# EAGLE design RQ2_analog (EAGLE 7.7.0)
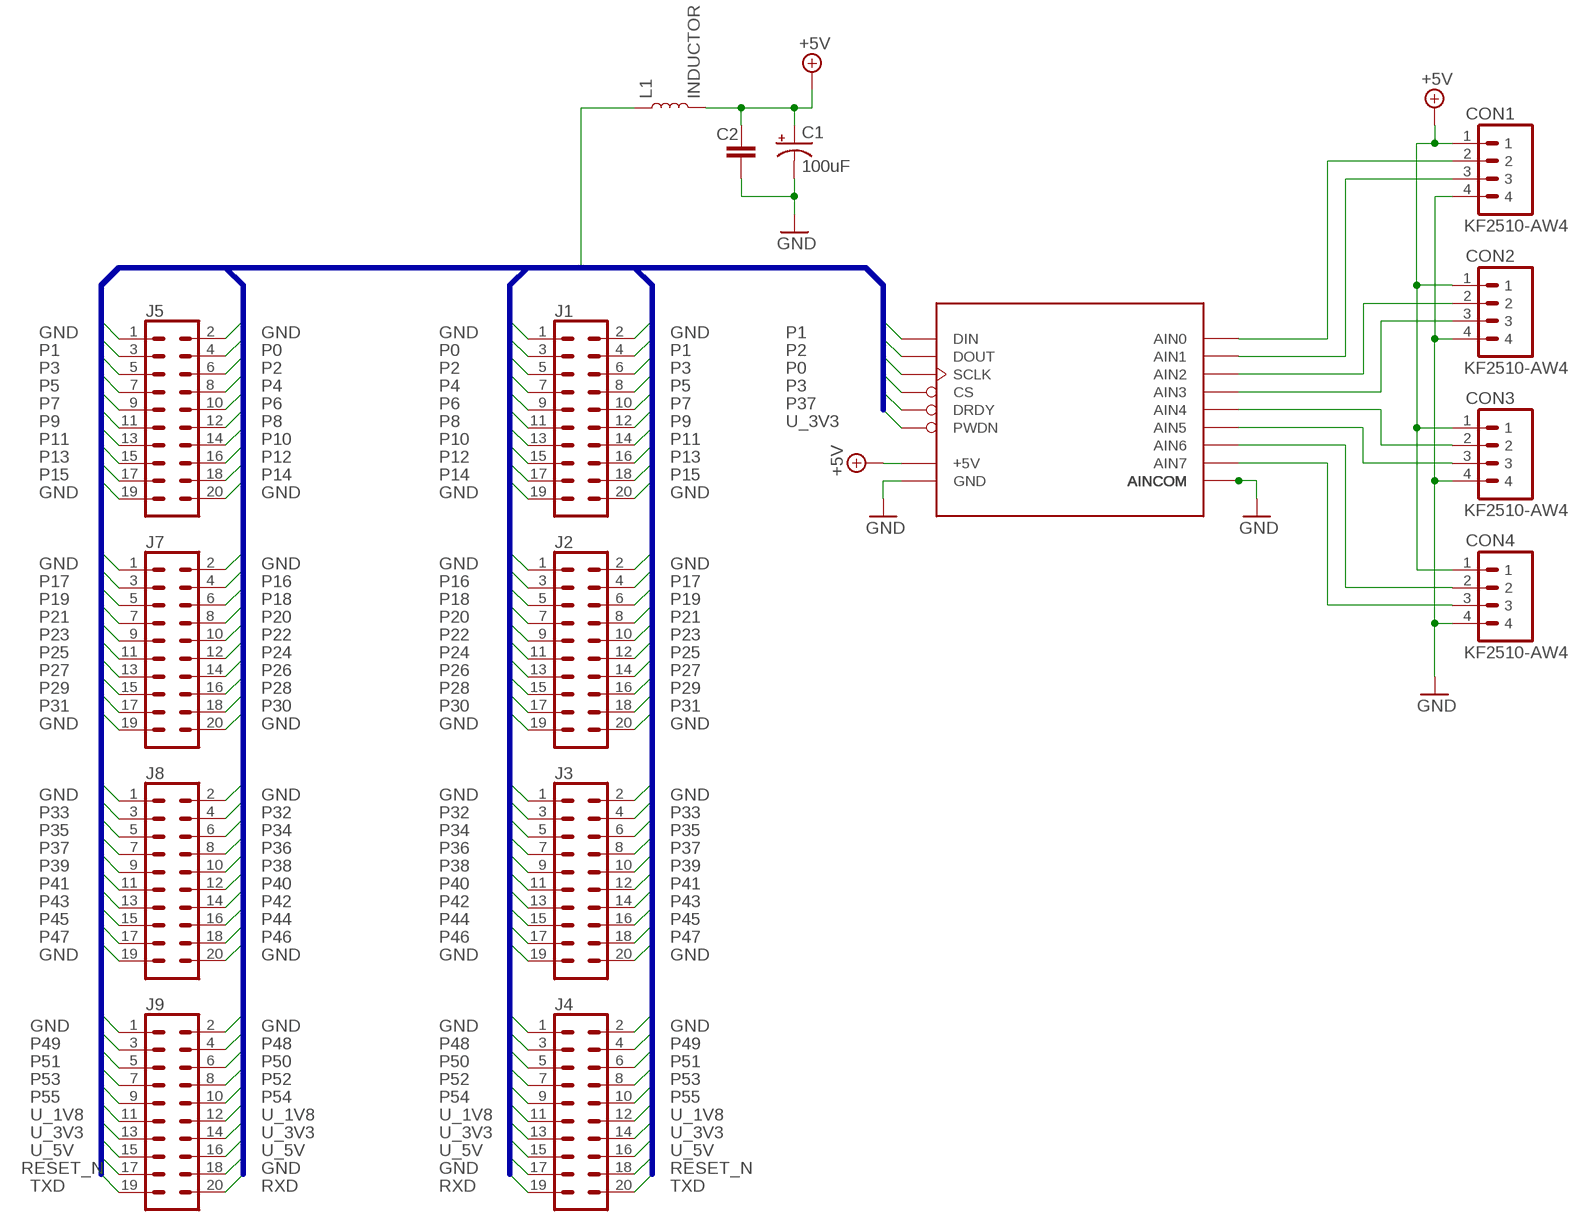
[diagram p0: schematic, sheet 1]

## Parts
C1  100uF  100UF-POLAR-10X10.5-63V-20%  [NIC_10X10.5_CAP]
C2  22uF  22UF-1210-16V-20%  [1210]
CON1  KF2510-AW4  [KF2510-AW4]
CON2  KF2510-AW4  [KF2510-AW4]
CON3  KF2510-AW4  [KF2510-AW4]
CON4  KF2510-AW4  [KF2510-AW4]
J1  CONN_10X2SMT  [2X10_SMT]
J2  CONN_10X2SMT  [2X10_SMT]
J3  CONN_10X2SMT  [2X10_SMT]
J4  CONN_10X2SMT  [2X10_SMT]
J5  CONN_10X2SMT  [2X10_SMT]
J7  CONN_10X2SMT  [2X10_SMT]
J8  CONN_10X2SMT  [2X10_SMT]
J9  CONN_10X2SMT  [2X10_SMT]
L1  INDUCTOR  [1040]
U$1  ADS1256_MODULE  [ADS1256_MODULE]

## Nets
+5V: C1.+ C2.1 CON1.1 CON2.1 CON3.1 CON4.1 L1.2 U$1.+5V
GND: C1.- C2.2 CON1.4 CON2.4 CON3.4 CON4.4 J1.1 J1.2 J1.19 J1.20 J2.1 J2.2 J2.19 J2.20 J3.1 J3.2 J3.19 J3.20 J4.1 J4.2 J4.17 J5.1 J5.2 J5.19 J5.20 J7.1 J7.2 J7.19 J7.20 J8.1 J8.2 J8.19 J8.20 J9.1 J9.2 J9.18 U$1.AINCOM0(AINCOM) U$1.AINCOM1(AINCOM) U$1.AINCOM2(AINCOM) U$1.AINCOM3(AINCOM) U$1.AINCOM4(AINCOM) U$1.AINCOM5(AINCOM) U$1.AINCOM6(AINCOM) U$1.AINCOM7(AINCOM) U$1.GND
N$1: CON1.2 U$1.AIN0
N$2: CON1.3 U$1.AIN1
N$3: CON2.2 U$1.AIN2
N$4: CON2.3 U$1.AIN3
N$5: CON3.2 U$1.AIN4
N$6: CON3.3 U$1.AIN5
N$7: CON4.2 U$1.AIN6
N$8: CON4.3 U$1.AIN7
P0: J1.3 J5.4 U$1.SCLK
P1: J1.4 J5.3 U$1.DIN
P2: J1.5 J5.6 U$1.DOUT
P3: J1.6 J5.5 U$1.CS
P4: J1.7 J5.8
P5: J1.8 J5.7
P6: J1.9 J5.10
P7: J1.10 J5.9
P8: J1.11 J5.12
P9: J1.12 J5.11
P10: J1.13 J5.14
P11: J1.14 J5.13
P12: J1.15 J5.16
P13: J1.16 J5.15
P14: J1.17 J5.18
P15: J1.18 J5.17
P16: J2.3 J7.4
P17: J2.4 J7.3
P18: J2.5 J7.6
P19: J2.6 J7.5
P20: J2.7 J7.8
P21: J2.8 J7.7
P22: J2.9 J7.10
P23: J2.10 J7.9
P24: J2.11 J7.12
P25: J2.12 J7.11
P26: J2.13 J7.14
P27: J2.14 J7.13
P28: J2.15 J7.16
P29: J2.16 J7.15
P30: J2.17 J7.18
P31: J2.18 J7.17
P32: J3.3 J8.4
P33: J3.4 J8.3
P34: J3.5 J8.6
P35: J3.6 J8.5
P36: J3.7 J8.8
P37: J3.8 J8.7 U$1.DRDY
P38: J3.9 J8.10
P39: J3.10 J8.9
P40: J3.11 J8.12
P41: J3.12 J8.11
P42: J3.13 J8.14
P43: J3.14 J8.13
P44: J3.15 J8.16
P45: J3.16 J8.15
P46: J3.17 J8.18
P47: J3.18 J8.17
P48: J4.3 J9.4
P49: J4.4 J9.3
P50: J4.5 J9.6
P51: J4.6 J9.5
P52: J4.7 J9.8
P53: J4.8 J9.7
P54: J4.9 J9.10
P55: J4.10 J9.9
RESET_N: J4.18 J9.17
RXD: J4.19 J9.20
TXD: J4.20 J9.19
U_1V8: J4.11 J4.12 J9.11 J9.12
U_3V3: J4.13 J4.14 J9.13 J9.14 U$1.PWDN
U_5V: J4.15 J4.16 J9.15 J9.16 L1.1

## Buses
P[0..55],RXD,TXD,BOOT_SCLK,BOOT_MISO,BOOT_MOSI,RESET_N,XIN,XOUT,U_1V8,U_3V3,U_5V,U_IN,GND

## Library data of the parts
C1 = SparkFun-Capacitors:100UF-POLAR: 100µF polarized capacitors A capacitor is a passive two-terminal electrical component used to store electrical energy temporarily in an electric field.; PROD_ID: CAP-08362
C2 = SparkFun-Capacitors:22UF: 22µF ceramic capacitors A capacitor is a passive two-terminal electrical component used to store electrical energy temporarily in an electric field.
CON1-CON4 = connector:KF2510-AW4
J1-J5 J7-J9 = SparkFun-Connectors:CONN_10X2: Multi connection point. Often used as Generic Header-pin footprint for 0.1 inch spaced/style header connections On any of the 0.1 inch spaced packages, you can populate with these: Break Away Headers - Straight <https://www.sparkfun.com/products/116> (PRT-00116) Break Away Male Headers - Right Angle <https://www.sparkfun.com/products/553> (PRT-00553) Female Headers <https://www.sparkfun.com/products/115> (PRT-00115) Break Away Headers - Machine Pin <https://www.sparkfun.com/products/117> (PRT-00117) Break Away Female Headers - Swiss Machine Pin <https://www.sparkfun.com/products/743> (PRT-00743) Special note about the "SPECIAL" package: This was SPECIALLY designed to be used with our Graphic LCD Backpack. Be sure you want to use this! It is not only staggered on each line of header holes, but IT IS ALSO offset of the center point of the top and bottom lines by 5 mil. This causes the headers to lock into place on the "standard" footprint on the LCD screen. The extra squares on the tdocu layer are there simply to reference other pins (if you were to actually populate a longer header than ten long - this is what we do with the backpacks).
L1 = SparkFun-Coils:INDUCTOR: Inductors Resist changes in electrical current. Basically a coil of wire. SparkFun Products: SparkFun Load Cell Amplifier - HX711 <https://www.sparkfun.com/products/13879> IOIO-OTG - V2.2 <https://www.sparkfun.com/products/13613>
U$1 = arduino_modules:ADS1256_MODULE

## Board
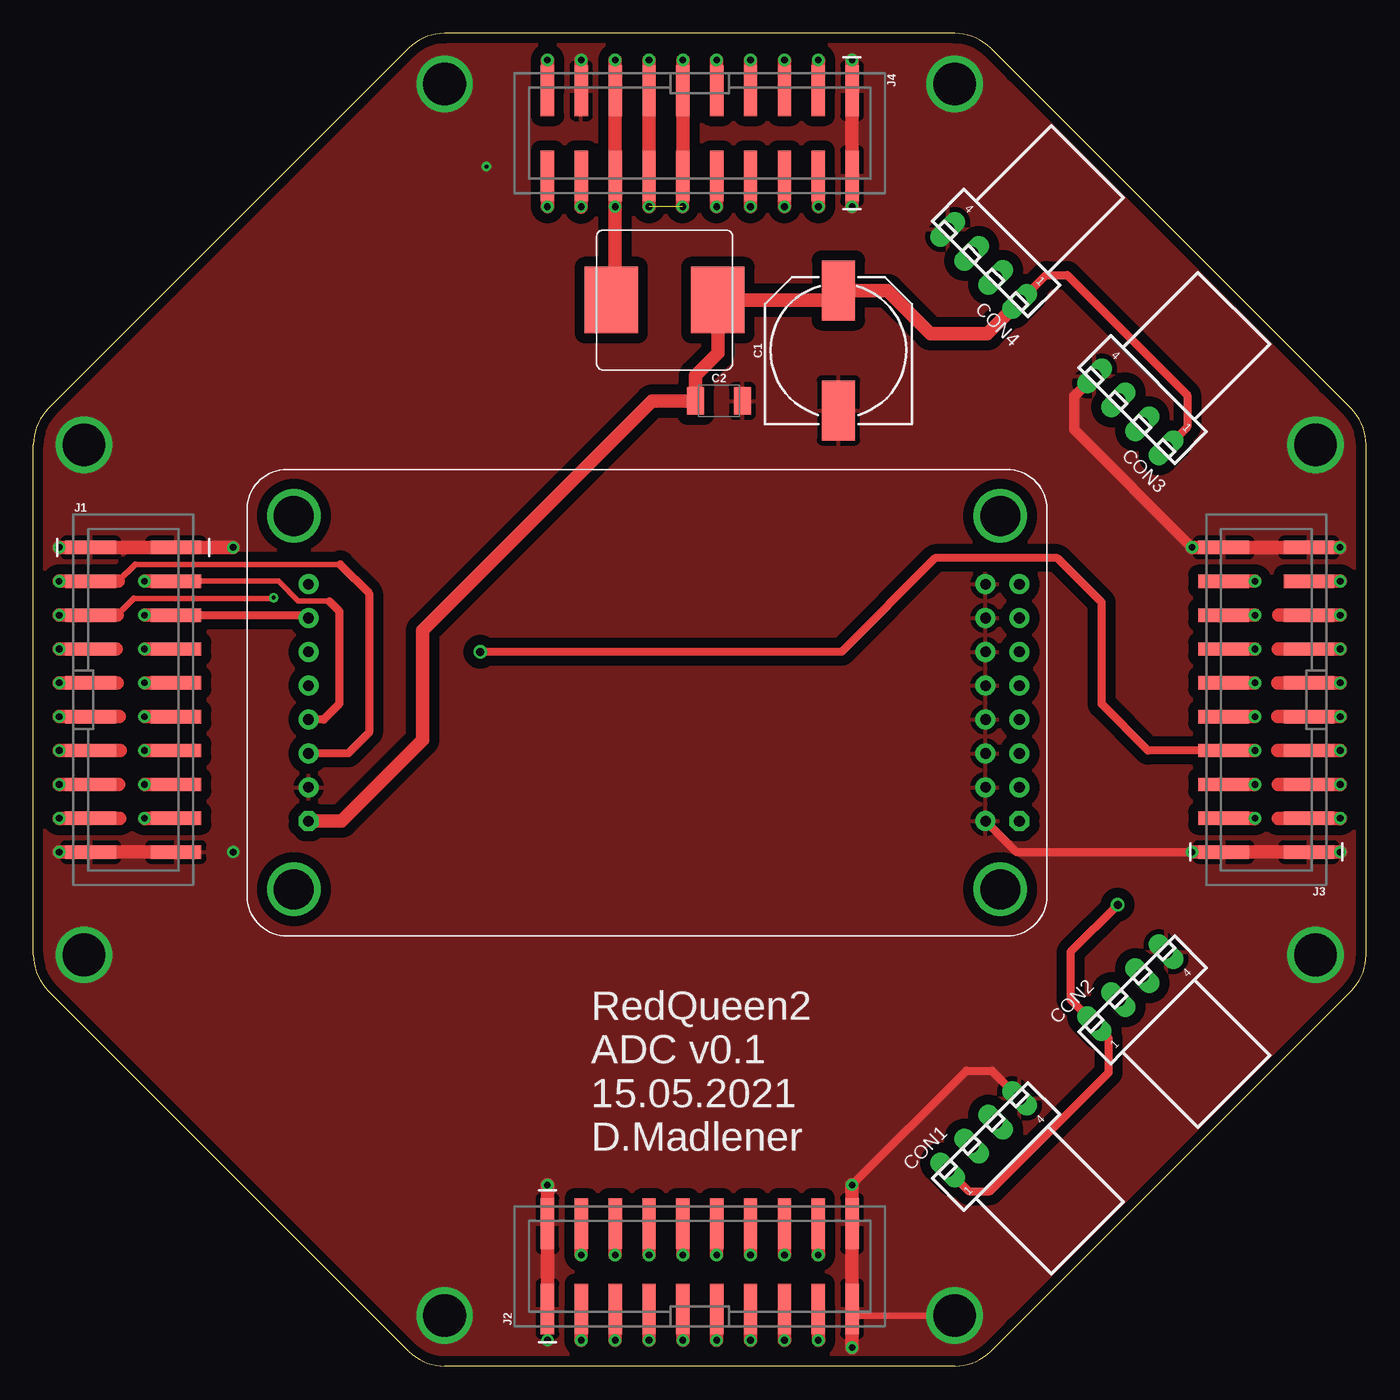
[diagram p1: board, top side]
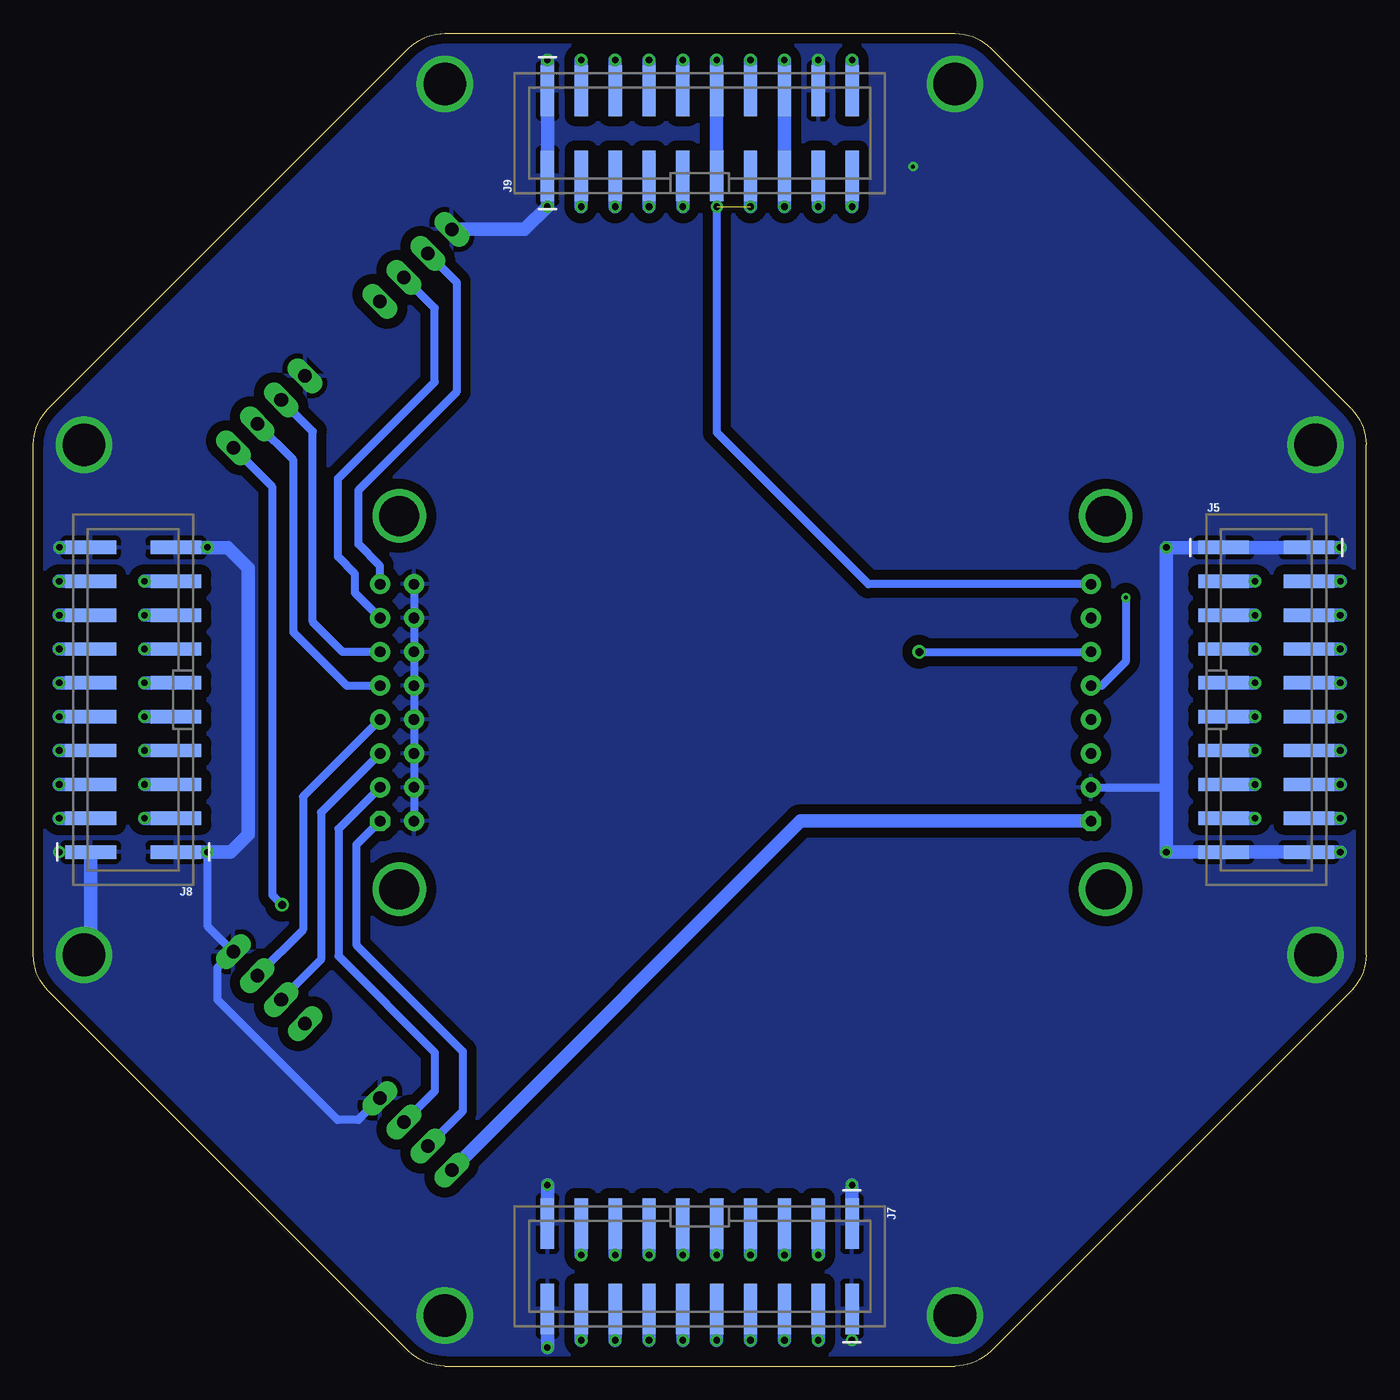
[diagram p2: board, bottom side, seen from below]

Size 100 x 100 mm. Coordinates in mm from the lower left corner, seen from the top.
Outline: 73.64,2.93 73.64,2.93
Outline: 97.07,73.64 97.07,73.64
Outline: 73.64,97.07 73.64,97.07
Outline: 98.89,28.17 arc45 100,30.86 100,69.14 arc45 98.89,71.83 71.83,98.89 arc45 69.13,100 30.86,100 arc45 28.17,98.89 1.11,71.83 arc45 0,69.14 0,30.87 arc45 1.11,28.18 28.18,1.11 arc45 30.87,0 69.13,0 arc45 71.83,1.11 98.89,28.17
Copper layers (1*16): Top 0.035mm / dielectric 1.5mm / Bottom 0.035mm
Design rules "default *": minimum track width 0.2mm, minimum drill 0.3mm, track to track 6mil, track to pad 6mil, pad to pad 6mil, via to via 6mil, smd to smd 6mil, copper to edge 6mil, drill to drill 6mil, minimum pad ring 10mil, minimum via ring 8mil, stop-mask expansion 4mil, vias tented up to drill 0mil, thermal gap 15mil

### Footprints (pad centres in the part's own frame; a part is rotated, then mirrored left to right if it is on the bottom)
NIC_10X10.5_CAP = smd 4.5 x 2.5: + 4.5,0; - -4.5,0
1210 = smd 1.27 x 2.06: 1 -1.755,0; 2 1.755,0
KF2510-AW4 = drill 1.016 long: 1 0,0; 2 2.54,0; 3 5.08,0; 4 7.62,0
2X10_SMT = smd 3.8 x 1: 1 -3.2,11.43; 2 3.2,11.43; 3 -3.2,8.89; 4 3.2,8.89; 5 -3.2,6.35; 6 3.2,6.35; 7 -3.2,3.81; 8 3.2,3.81; 9 -3.2,1.27; 10 3.2,1.27; 11 -3.2,-1.27; 12 3.2,-1.27; 13 -3.2,-3.81; 14 3.2,-3.81; 15 -3.2,-6.35; 16 3.2,-6.35; 17 -3.2,-8.89; 18 3.2,-8.89; 19 -3.2,-11.43; 20 3.2,-11.43
1040 = smd 4 x 5: 1 -4,0; 2 4,0
ADS1256_MODULE = drill 0.8 pad 1.5 octagon: +5V 53.34,0; AIN0 0,0 | drill 0.8 pad 1.5: AIN1 0,-2.54; AIN2 0,-5.08; AIN3 0,-7.62; AIN4 0,-10.16; AIN5 0,-12.7; AIN6 0,-15.24; AIN7 0,-17.78; AINCOM0 2.54,0; AINCOM1 2.54,-2.54; AINCOM2 2.54,-5.08; AINCOM3 2.54,-7.62; AINCOM4 2.54,-10.16; AINCOM5 2.54,-12.7; AINCOM6 2.54,-15.24; AINCOM7 2.54,-17.78; CS 53.34,-15.24; DIN 53.34,-7.62; DOUT 53.34,-10.16; DRDY 53.34,-12.7; GND 53.34,-2.54; PWDN 53.34,-17.78; SCLK 53.34,-5.08 | drill 3: P$1 1.44,-22.89; P$2 1.44,5.11; P$3 54.44,5.11; P$4 54.44,-22.89

### Placement (x,y rotation side)
C1  60.4,76.2 90 top
C2  51.44,72.42 0 top
CON1  68.61,14.71 45 top
CON2  79.61,25.71 45 top
CON3  85,68.9 135 top
CON4  74,79.9 135 top
J1  7.5,50 0 top
J2  50,7.5 90 top
J3  92.5,50 180 top
J4  50,92.5 270 top
J5  7.5,50 0 bottom
J7  50,7.5 270 bottom
J8  92.5,50 180 bottom
J9  50,92.5 90 bottom
L1  47.36,79.99 0 top
U$1  73.98,40.89 180 top

### Tracks (layer width: path | path; a pad name or v marks a point on that pad's centre or on a via)
+5V  (via drill 0.6)
  Top 0.6: CON4.1 75.97,81.87 77.57,81.87 86.57,72.87 86.57,70.47 CON3.1 | v81.35,34.62 77.81,31.08 77.81,27.51 CON2.1 80.69,24.63 80.69,22.04 71.78,13.13 70.19,13.13 CON1.1
  Top 1: CON4.1 71.57,77.47 67.31,77.47 64.08,80.7 C1.+ 59.69,79.99 L1.2 51.36,76.01 49.69,74.33 C2.1 46.42,72.42 29.21,55.21 29.21,46.99 23.12,40.9 U$1.+5V
  Bottom 0.6: v81.35,34.62 82.05,35.32 82.05,65.95 CON3.1
  Bottom 1: U$1.+5V 42.43,40.89 CON1.1
GND  (via drill 0.3, 0.5, 3.2)
  Top 0.3: 92.94,61.45 92.95,61.43
  Top 0.5: 61.43,88.94 61.4,88.91 | J7.20 61.93,3.8 v69.12,3.8
  Top 0.6: U$1.AINCOM0 73.77,38.57 v86.94,38.57 | v61.43,13.6 69.99,22.16 71.94,22.16 CON1.4
  Top 0.8: v86.94,61.44 78.1,70.27 78.1,72.78 CON3.4
  Top 1: J7.2 J7.1 v38.57,13.6 | J5.19 J5.20 v1.94,38.57 | v61.43,13.6 J7.19 J7.20 v61.43,1.4 | v98.06,38.57 J8.2 J8.1 v86.94,38.57 | v98.03,61.43 J8.20 92.95,61.43 J8.19 | v61.43,98 J9.2 61.43,88.94 | J9.1 v61.43,87 | 88.93,61.44 v86.94,61.44 | v1.94,61.43 J5.2 J5.1 v14.99,61.43 | J4.17 v41.11,98
  Bottom 0.406: 14.99,43.43 14.99,43.6
  Bottom 0.6: U$1.GND 14.99,43.43 | U$1.AINCOM7 U$1.AINCOM6 U$1.AINCOM5 U$1.AINCOM4 U$1.AINCOM3 U$1.AINCOM2 U$1.AINCOM1 U$1.AINCOM0 | CON1.4 75.62,18.48 77.17,18.48 86.18,27.49 86.18,29.92 CON2.4 86.94,33.04 v86.94,38.57
  Bottom 0.8: v14.99,38.57 v14.99,38.58
  Bottom 1: J7.20 v61.43,1.4 | J7.1 v38.57,13.6 | J7.19 v61.43,13.6 | v1.94,38.57 J5.20 J5.19 v14.99,38.57 | v1.94,61.43 J5.2 J5.1 v14.99,61.43 14.99,43.6 v14.99,38.58 | v61.43,98 J9.2 J9.1 v61.43,87 63.14,85.29 CON4.4 | J8.19 v86.94,61.44 85.44,61.44 83.89,59.89 83.89,39.89 85.21,38.57 v86.94,38.57 J8.1 | J8.20 v98.03,61.43 | J8.2 95.7,31.36 v96.2,30.86 | v41.11,98 J4.17
  other vias: 30.86,3.8 3.8,30.86 3.8,69.12 69.12,96.2 96.2,69.12 30.86,96.2 38.58,1.94 34,90
  pour Top (isolate 0.75): 100,29.32 70.7,0 29.3,0 0,29.3 0,70.7 29.3,100 70.7,100 100,70.7
  pour Bottom (isolate 0.75): 0.01,29.34 29.31,0.03 70.71,0.03 100.01,29.33 100.01,70.73 70.71,100.03 29.31,100.03 0.01,70.73
N$1
  Bottom 0.6: U$1.AIN0 75.77,39.11 75.77,31.61 67.79,23.63 67.79,19.12 CON1.2
N$2
  Bottom 0.6: U$1.AIN1 77.11,40.31 77.11,30.77 69.88,23.54 69.88,20.62 CON1.3
N$3
  Bottom 0.6: U$1.AIN2 78.41,41.55 78.41,30.5 CON2.2
N$4
  Bottom 0.6: U$1.AIN3 79.76,42.74 79.76,32.74 CON2.3
N$5
  Bottom 0.6: U$1.AIN4 76.48,51.05 80.48,55.05 80.48,67.97 CON3.2
N$6
  Bottom 0.6: U$1.AIN5 76.79,53.59 79.04,55.84 79.04,70.12 CON3.3
N$7
  Bottom 0.6: U$1.AIN6 75.86,58.01 75.86,59.45 77.14,60.73 77.14,66.6 69.89,73.85 69.89,79.38 CON4.2
N$8
  Bottom 0.6: U$1.AIN7 73.98,60.04 75.61,61.67 75.61,65.72 68.21,73.12 68.21,81.29 CON4.3
P0  (via drill 0.5)
  Top 0.406: 7.65,60.16 23.03,60.16
  Top 0.5: 7.65,60.16 6.38,58.89
  Top 0.6: 23.03,60.16 25.19,58 25.19,47.53 23.63,45.97 U$1.SCLK
  Top 1: 6.38,58.89 J5.4 v1.94,58.89
  Bottom 1: v1.94,58.89 J5.4
P1  (via drill 0.5)
  Top 0.406: 22.2,57.4 19.89,57.4 18.4,58.89 J5.3
  Top 0.6: 22.2,57.4 22.96,56.64 22.96,49.69 21.78,48.51 U$1.DIN
  Top 1: J5.3 v8.34,58.89
  Bottom 1: v8.34,58.89 J5.3
P2  (via drill 0.3, 0.5)
  Top 0.406: 7.54,57.6 17.98,57.6 v18.03,57.66
  Top 0.5: 7.54,57.6 6.29,56.35
  Top 1: 6.29,56.35 J5.6 v1.94,56.35
  Bottom 0.6: v18.03,57.66 18.03,52.87 19.85,51.05 U$1.DOUT
  Bottom 1: v1.94,56.35 J5.6
P3  (via drill 0.5)
  Top 0.6: J5.5 20.43,56.35 U$1.CS
  Top 1: J5.5 v8.34,56.35
  Bottom 1: J5.5 v8.34,56.35
P4  (via drill 0.5)
  Top 1: 6.23,53.81 J5.8 v1.94,53.81
  Bottom 1: J5.8 v1.94,53.81
P5  (via drill 0.5)
  Top 1: J5.7 v8.34,53.81
  Bottom 1: v8.34,53.81 J5.7
P6  (via drill 0.5)
  Top 1: 6.29,51.27 J5.10 v1.94,51.27
  Bottom 1: v1.94,51.27 J5.10
P7  (via drill 0.5)
  Top 1: J5.9 v8.34,51.27
  Bottom 1: J5.9 v8.34,51.27
P8  (via drill 0.5)
  Top 1: 6.45,48.73 J5.12 v1.94,48.73
  Bottom 1: J5.12 v1.94,48.73
P9  (via drill 0.5)
  Top 1: J5.11 v8.34,48.73
  Bottom 1: v8.34,48.73 J5.11
P10  (via drill 0.5)
  Top 1: 6.5,46.19 J5.14 v1.94,46.19
  Bottom 1: v1.94,46.19 J5.14
P11  (via drill 0.5)
  Top 1: J5.13 v8.34,46.19
  Bottom 1: J5.13 v8.34,46.19
P12  (via drill 0.5)
  Top 1: 6.39,43.65 J5.16 v1.94,43.65
  Bottom 1: v1.94,43.65 J5.16
P13  (via drill 0.5)
  Top 1: J5.15 v8.34,43.65
  Bottom 1: v8.34,43.65 J5.15
P14  (via drill 0.5)
  Top 1: 6.46,41.11 J5.18 v1.94,41.11
  Bottom 1: J5.18 v1.94,41.11
P15  (via drill 0.5)
  Top 1: J5.17 v8.34,41.11
  Bottom 1: J5.17 v8.34,41.11
P16  (via drill 0.5)
  Top 1: J7.4 v41.11,1.94
  Bottom 1: J7.4 v41.11,1.94
P17  (via drill 0.5)
  Top 1: v41.11,8.34 J7.3
  Bottom 1: J7.3 v41.11,8.34
P18  (via drill 0.5)
  Top 1: J7.6 v43.65,1.94
  Bottom 1: J7.6 v43.65,1.94
P19  (via drill 0.5)
  Top 1: v43.65,8.34 J7.5
  Bottom 1: J7.5 v43.65,8.34
P20  (via drill 0.5)
  Top 1: J7.8 v46.19,1.94
  Bottom 1: J7.8 v46.19,1.94
P21  (via drill 0.5)
  Top 1: J7.7 v46.19,8.34
  Bottom 1: J7.7 v46.19,8.34
P22  (via drill 0.5)
  Top 1: J7.10 v48.73,1.94
  Bottom 1: J7.10 v48.73,1.94
P23  (via drill 0.5)
  Top 1: v48.73,8.34 J7.9
  Bottom 1: J7.9 v48.73,8.34
P24  (via drill 0.5)
  Top 1: J7.12 v51.27,1.94
  Bottom 1: J7.12 v51.27,1.94
P25  (via drill 0.5)
  Top 1: J7.11 v51.27,8.34
  Bottom 1: J7.11 v51.27,8.34
P26  (via drill 0.5)
  Top 1: J7.14 v53.81,1.94
  Bottom 1: J7.14 v53.81,1.94
P27  (via drill 0.5)
  Top 1: J7.13 v53.81,8.35 v53.8,8.34
  Bottom 0.5: v53.81,8.35 v53.8,8.34
  Bottom 1: J7.13 v53.81,8.35
P28  (via drill 0.5)
  Top 1: J7.16 v56.35,1.94
  Bottom 1: J7.16 v56.35,1.94
P29  (via drill 0.5)
  Top 1: J7.15 v56.35,8.34
  Bottom 1: J7.15 v56.35,8.34
P30  (via drill 0.5)
  Top 1: J7.18 v58.89,1.94
  Bottom 1: J7.18 v58.89,1.94
P31  (via drill 0.5)
  Top 1: J7.17 v58.89,8.35 v58.88,8.34
  Bottom 0.5: v58.89,8.35 v58.88,8.34
  Bottom 1: J7.17 v58.89,8.35
P32  (via drill 0.5)
  Top 1: v98.06,41.11 J8.4 93.39,41.11
  Bottom 1: v98.06,41.11 J8.4
P33  (via drill 0.5)
  Top 1: v91.66,41.11 J8.3
  Bottom 1: v91.66,41.11 J8.3
P34  (via drill 0.5)
  Top 1: v98.06,43.65 J8.6 93.42,43.65
  Bottom 1: v98.06,43.65 J8.6
P35  (via drill 0.5)
  Top 1: J8.5 v91.66,43.65
  Bottom 1: v91.66,43.65 J8.5
P36  (via drill 0.5)
  Top 1: v98.06,46.19 J8.8 93.38,46.19
  Bottom 1: v98.06,46.19 J8.8
P37  (via drill 0.5, 0.6)
  Top 0.6: J8.7 83.63,46.19 80.15,49.67 80.15,57.3 76.83,60.62 67.66,60.62 60.64,53.6 v33.53,53.6
  Top 1: J8.7 v91.66,46.19
  Bottom 0.406: U$1.DRDY
  Bottom 0.6: v33.53,53.6 U$1.DRDY
  Bottom 1: v91.66,46.19 J8.7
P38  (via drill 0.5)
  Top 1: v98.06,48.73 J8.10 93.39,48.73
  Bottom 1: v98.06,48.73 J8.10
P39  (via drill 0.5)
  Top 1: J8.9 v91.66,48.73
  Bottom 1: v91.66,48.73 J8.9
P40  (via drill 0.5)
  Top 1: 93.38,51.27 J8.12 v98.06,51.27
  Bottom 1: v98.06,51.27 J8.12
P41  (via drill 0.5)
  Top 1: J8.11 v91.66,51.27
  Bottom 1: v91.66,51.27 J8.11
P42  (via drill 0.5)
  Top 1: v98.06,53.8 v98.05,53.81 J8.14 93.4,53.81
  Bottom 1: J8.14 v98.06,53.8
P43  (via drill 0.5)
  Top 1: J8.13 v91.66,53.81
  Bottom 1: v91.66,53.81 J8.13
P44  (via drill 0.5)
  Top 1: 93.44,56.35 J8.16 v98.06,56.35
  Bottom 1: v98.06,56.35 J8.16
P45  (via drill 0.5)
  Top 1: J8.15 v91.66,56.35
  Bottom 1: v91.66,56.35 J8.15
P46  (via drill 0.5)
  Top 1: J8.18 v98.06,58.89
  Bottom 1: v98.06,58.89 J8.18
P47  (via drill 0.5)
  Top 1: J8.17 v91.66,58.89
  Bottom 1: v91.66,58.89 J8.17
P48  (via drill 0.5)
  Top 1: J4.3 v58.89,98
  Bottom 1: v58.89,98 J4.3
P49  (via drill 0.5)
  Top 1: J4.4 58.89,87.06 v58.9,87
  Bottom 1: v58.9,87 J4.4
P50  (via drill 0.5)
  Top 1: J4.5 v56.35,98
  Bottom 1: v56.35,98 J4.5
P51  (via drill 0.5)
  Top 1: J4.6 v56.35,87
  Bottom 1: v56.35,87 J4.6
P52  (via drill 0.5)
  Top 1: J4.7 v53.81,98
  Bottom 1: v53.81,98 J4.7
P53  (via drill 0.5)
  Top 1: J4.8 v53.81,87
  Bottom 1: v53.81,87 J4.8
P54  (via drill 0.5)
  Top 1: J4.9 v51.27,98
  Bottom 1: v51.27,98 J4.9
P55  (via drill 0.5)
  Top 1: J4.10 v51.27,87
  Bottom 1: v51.27,87 J4.10
RESET_N  (via drill 0.5)
  Top 1: J9.17 41.11,86.94 v41.1,87
  Bottom 1: J9.17 v41.1,87
RXD  (via drill 0.5)
  Top 1: J9.20 v38.57,98
  Bottom 1: J9.20 v38.57,98
TXD  (via drill 0.5)
  Top 1: 38.57,90.06 J9.19 v38.57,87
  Bottom 1: J9.19 v38.57,87
U_1V8  (via drill 0.5)
  Top 1: J4.12 J4.11 v48.73,98
  Bottom 1: v48.73,98 J4.11 J4.12
U_3V3  (via drill 0.5)  (1 unrouted)
  Top 0.5: 48.73,86.94 v48.72,87
  Top 1: v48.72,87 48.72,89.29 | v46.19,98 J4.13 J4.14 v46.19,87
  Bottom 0.6: U$1.PWDN 37.34,58.67 48.72,70.05 v48.72,87
  Bottom 1: v46.19,98 J4.13 | J4.14 v46.19,87
U_5V  (via drill 0.5)
  Top 1: v43.66,98 J9.16 J9.15 v43.65,87 43.65,80.28 L1.1
  Bottom 1: J9.16 J9.15 v43.65,87 | J9.16 v43.66,98

### Text on the board
tPlace: RedQueen2 / ADC v0.1 / 15.05.2021 / D.Madlener